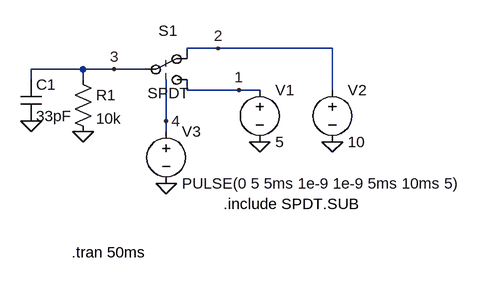
[diagram p0: schematic spdttst.asc]
spdttst.asc, the LTspice schematic file:
Version 4
SHEET 1 880 680
WIRE -64 240 -64 224
WIRE 16 224 -64 224
WIRE 16 240 16 224
WIRE 64 224 16 224
WIRE 112 224 64 224
WIRE 144 304 144 240
WIRE 144 320 144 304
WIRE 176 208 176 192
WIRE 176 256 176 240
WIRE 224 192 176 192
WIRE 256 256 176 256
WIRE 288 256 256 256
WIRE 400 192 224 192
WIRE 400 256 400 192
FLAG 400 336 0
FLAG 288 336 0
FLAG 144 400 0
FLAG 16 320 0
FLAG 256 256 1
FLAG 224 192 2
FLAG 64 224 3
FLAG 144 304 4
FLAG -64 304 0
SYMBOL SpecialFunctions\\SPDT 144 224 R0
WINDOW 0 -12 -59 Left 0
SYMATTR InstName S1
SYMATTR Value spdt
SYMBOL res 0 224 R0
SYMATTR InstName R1
SYMATTR Value 10k
SYMBOL voltage 288 240 R0
WINDOW 123 0 0 Left 0
WINDOW 39 0 0 Left 0
SYMATTR InstName V1
SYMATTR Value 5
SYMBOL voltage 400 240 R0
WINDOW 123 0 0 Left 0
WINDOW 39 0 0 Left 0
SYMATTR InstName V2
SYMATTR Value 10
SYMBOL voltage 144 304 R0
WINDOW 123 0 0 Left 0
WINDOW 39 0 0 Left 0
SYMATTR InstName V3
SYMATTR Value PULSE(0 5 5ms 1e-9 1e-9 5ms 10ms 5)
SYMBOL cap -80 240 R0
SYMATTR InstName C1
SYMATTR Value 33pF
TEXT 232 432 Left 0 !.include SPDT.SUB
TEXT -2 506 Left 0 !.tran 50ms

The netlist it stands for:
* spdttst.asc
XS1 1 2 3 4 SPDT spdt  ; pins no nc w cv
R1 3 0 10k
V1 1 0 5
V2 2 0 10
V3 4 0 PULSE(0 5 5ms 1e-9 1e-9 5ms 10ms 5)
C1 3 0 33pF
.include SPDT.SUB
.tran 50ms
.backanno
.end